# Altium project GN-1846-E-V2_HI3531A.PRJPCB (part 3 of 5)

## Sheet P06 Hi3531AV100(GND).SchDoc
size 420 x 297 mm
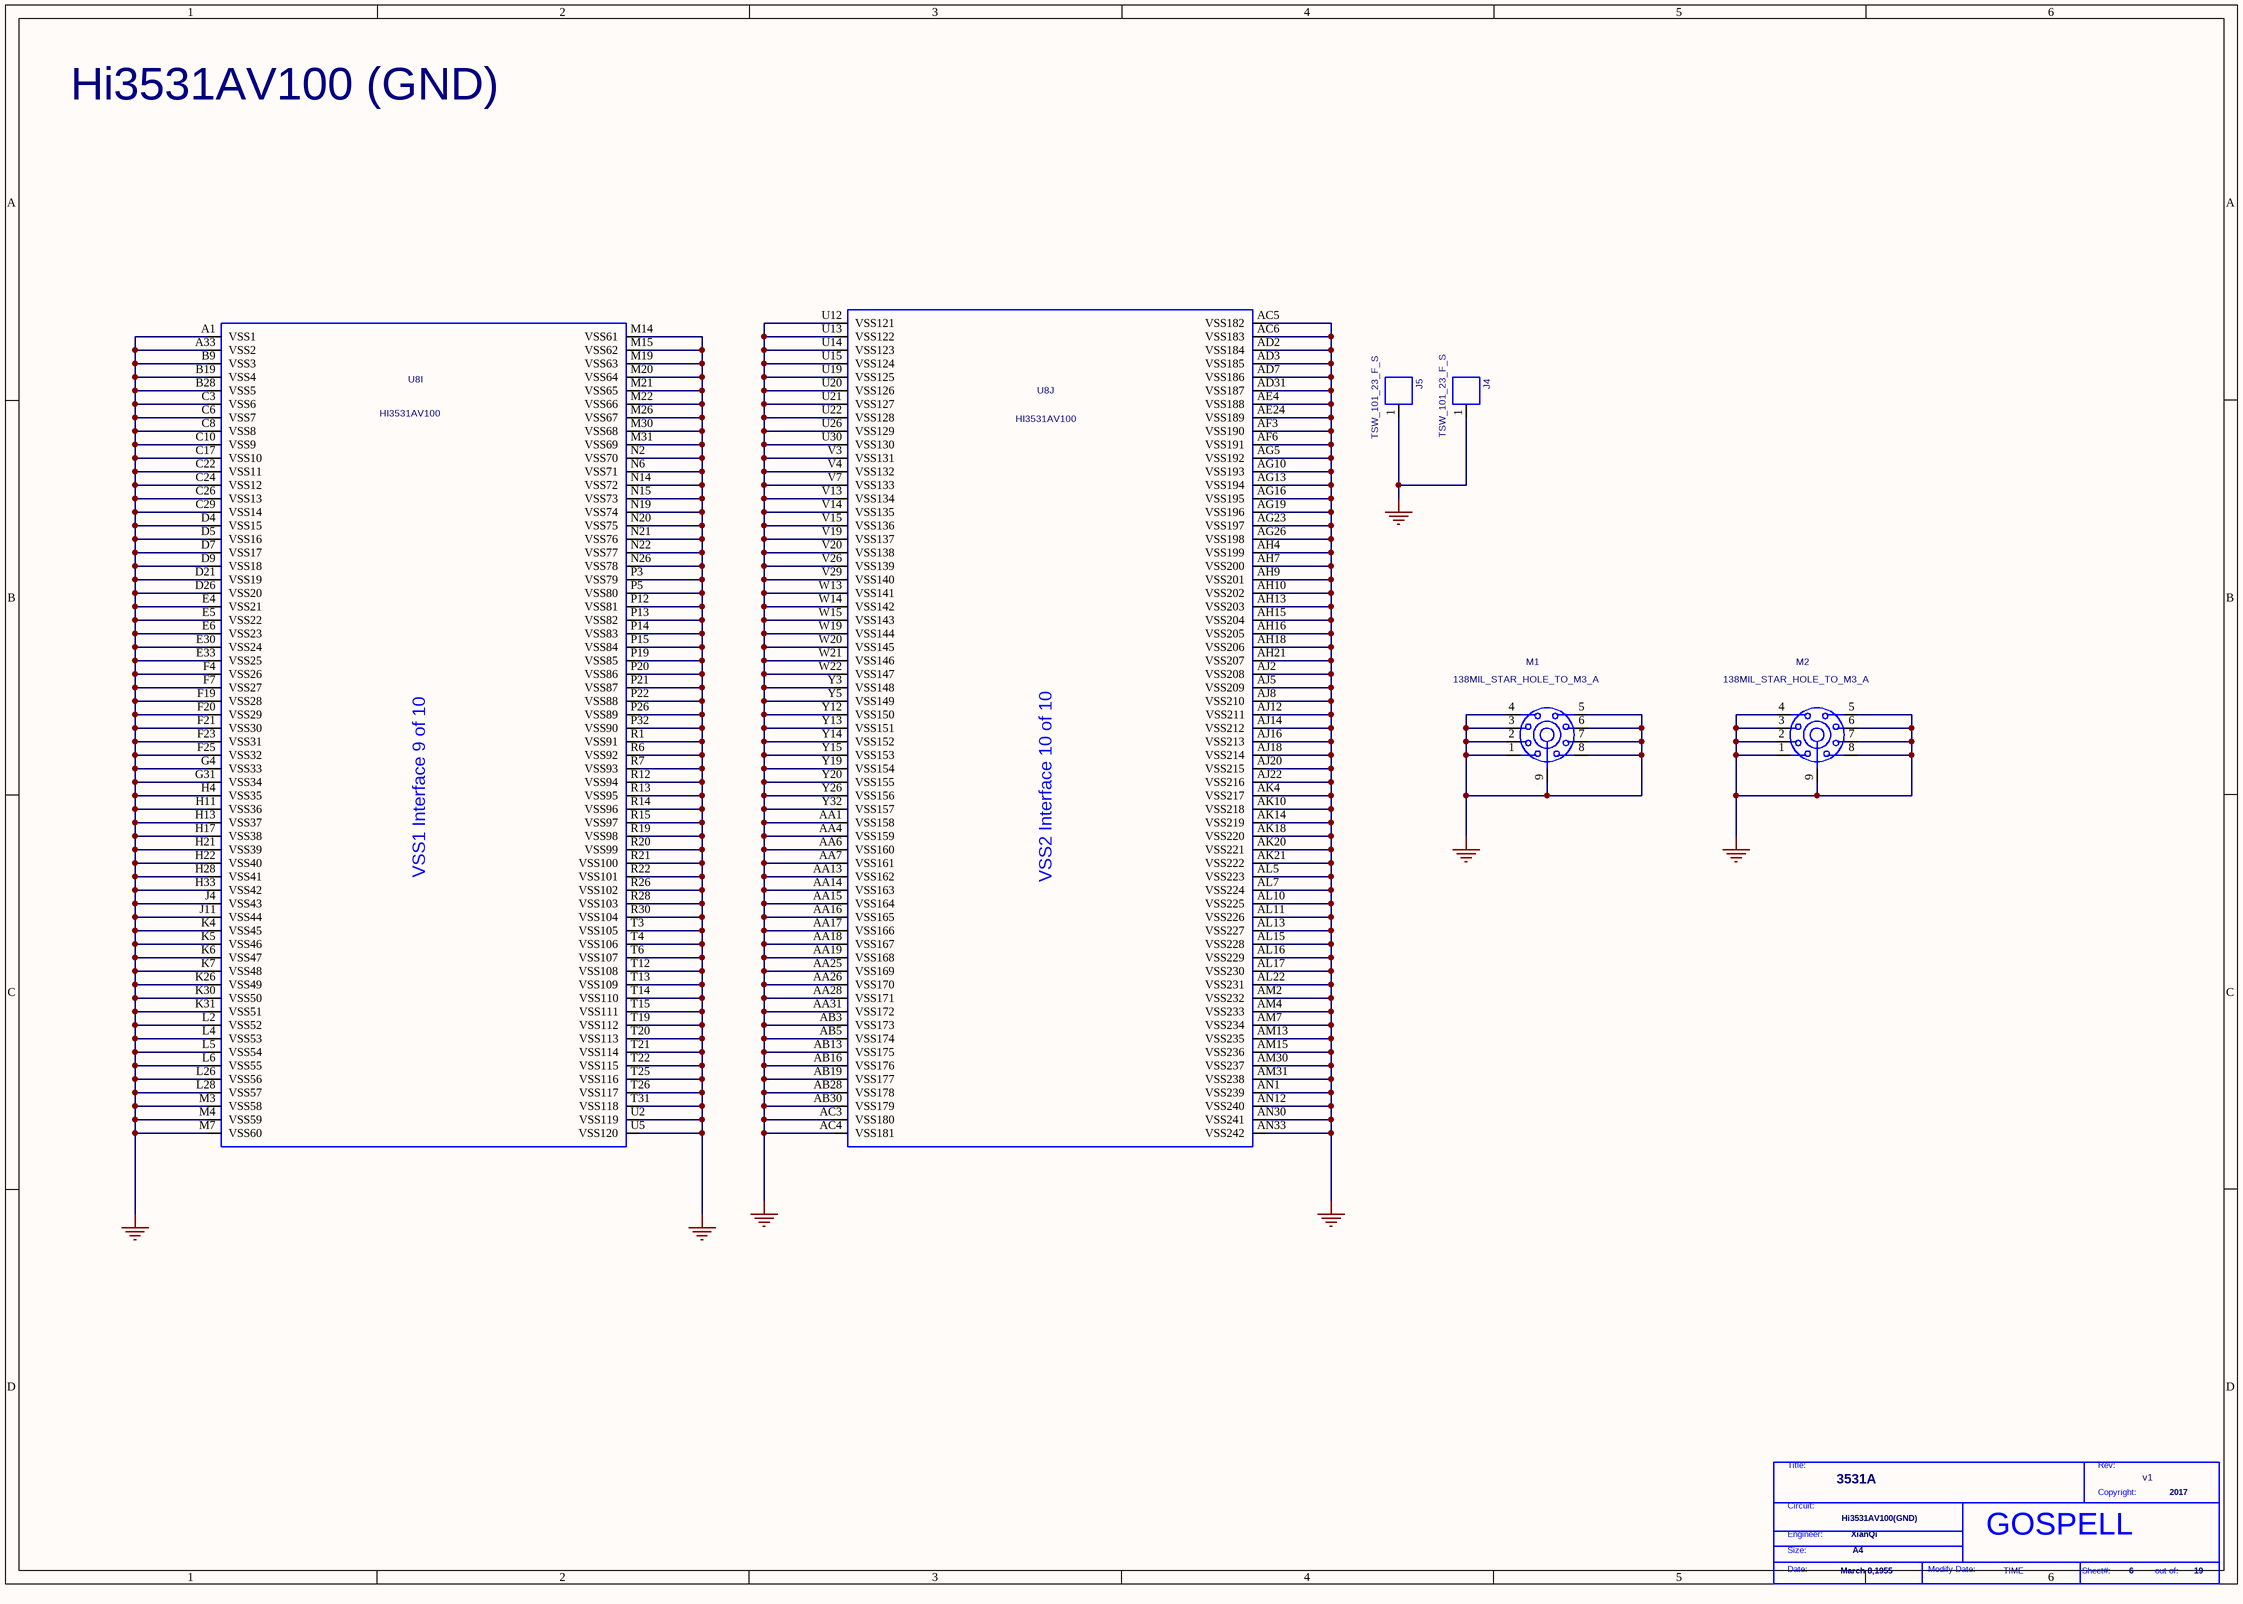
[diagram p12: P06 Hi3531AV100(GND).SchDoc]

### Parts
(Parts that share a designator on the sheet are numbered #1, #2 ... from top to bottom, then left to right.)
*#13  Page Modify Date: TIME  Engineer: XianQi  Copyright: 2017  Title: 3531A  RevCode: v1  Page Size: A4  Page Create Date: March 8,1955  Page Number: 6  Page Count: 19  Doc: Hi3531AV100(GND)  (hidden comment: GOSPELL)  (graphical)
J4  DEVICE: TSW_101_23_F_S  [SIP-1P]  (hidden comment: SIP-1P)
J5  DEVICE: TSW_101_23_F_S  [SIP-1P]  (hidden comment: SIP-1P)
M1  DEVICE: 138MIL_STAR_HOLE_TO_M3_A  [HOLE160-8STARAN]  (hidden comment: HOLE160-8STARAN)
M2  DEVICE: 138MIL_STAR_HOLE_TO_M3_A  [HOLE160-8STARAN]  (hidden comment: HOLE160-8STARAN)
U8  DEVICE: HI3531AV100  [BGA805-32-3333]  (hidden comment: BGA805-32-3333)  (parts I,J of 10)

### Nets
GND: J4.1 J5.1 M1.1(GND0) M1.2(GND1) M1.3(GND2) M1.4(GND3) M1.5(GND4) M1.6(GND5) M1.7(GND6) M1.8(GND7) M1.9(HOLE) M2.1(GND0) M2.2(GND1) M2.3(GND2) M2.4(GND3) M2.5(GND4) M2.6(GND5) M2.7(GND6) M2.8(GND7) M2.9(HOLE) U8.A1(VSS1) U8.A33(VSS2) U8.AA1(VSS158) U8.AA4(VSS159) U8.AA6(VSS160) U8.AA7(VSS161) U8.AA13(VSS162) U8.AA14(VSS163) U8.AA15(VSS164) U8.AA16(VSS165) U8.AA17(VSS166) U8.AA18(VSS167) U8.AA19(VSS168) U8.AA25(VSS169) U8.AA26(VSS170) U8.AA28(VSS171) U8.AA31(VSS172) U8.AB3(VSS173) U8.AB5(VSS174) U8.AB13(VSS175) U8.AB16(VSS176) U8.AB19(VSS177) U8.AB28(VSS178) U8.AB30(VSS179) U8.AC3(VSS180) U8.AC4(VSS181) U8.AC5(VSS182) U8.AC6(VSS183) U8.AD2(VSS184) U8.AD3(VSS185) U8.AD7(VSS186) U8.AD31(VSS187) U8.AE4(VSS188) U8.AE24(VSS189) U8.AF3(VSS190) U8.AF6(VSS191) U8.AG5(VSS192) U8.AG10(VSS193) U8.AG13(VSS194) U8.AG16(VSS195) U8.AG19(VSS196) U8.AG23(VSS197) U8.AG26(VSS198) U8.AH4(VSS199) U8.AH7(VSS200) U8.AH9(VSS201) U8.AH10(VSS202) U8.AH13(VSS203) U8.AH15(VSS204) U8.AH16(VSS205) U8.AH18(VSS206) U8.AH21(VSS207) U8.AJ2(VSS208) U8.AJ5(VSS209) U8.AJ8(VSS210) U8.AJ12(VSS211) U8.AJ14(VSS212) U8.AJ16(VSS213) U8.AJ18(VSS214) U8.AJ20(VSS215) U8.AJ22(VSS216) U8.AK4(VSS217) U8.AK10(VSS218) U8.AK14(VSS219) U8.AK18(VSS220) U8.AK20(VSS221) U8.AK21(VSS222) U8.AL5(VSS223) U8.AL7(VSS224) U8.AL10(VSS225) U8.AL11(VSS226) U8.AL13(VSS227) U8.AL15(VSS228) U8.AL16(VSS229) U8.AL17(VSS230) U8.AL22(VSS231) U8.AM2(VSS232) U8.AM4(VSS233) U8.AM7(VSS234) U8.AM13(VSS235) U8.AM15(VSS236) U8.AM30(VSS237) U8.AM31(VSS238) U8.AN1(VSS239) U8.AN12(VSS240) U8.AN30(VSS241) U8.AN33(VSS242) U8.B9(VSS3) U8.B19(VSS4) U8.B28(VSS5) U8.C3(VSS6) U8.C6(VSS7) U8.C8(VSS8) U8.C10(VSS9) U8.C17(VSS10) U8.C22(VSS11) U8.C24(VSS12) U8.C26(VSS13) U8.C29(VSS14) U8.D4(VSS15) U8.D5(VSS16) U8.D7(VSS17) U8.D9(VSS18) U8.D21(VSS19) U8.D26(VSS20) U8.E4(VSS21) U8.E5(VSS22) U8.E6(VSS23) U8.E30(VSS24) U8.E33(VSS25) U8.F4(VSS26) U8.F7(VSS27) U8.F19(VSS28) U8.F20(VSS29) U8.F21(VSS30) U8.F23(VSS31) U8.F25(VSS32) U8.G4(VSS33) U8.G31(VSS34) U8.H4(VSS35) U8.H11(VSS36) U8.H13(VSS37) U8.H17(VSS38) U8.H21(VSS39) U8.H22(VSS40) U8.H28(VSS41) U8.H33(VSS42) U8.J4(VSS43) U8.J11(VSS44) U8.K4(VSS45) U8.K5(VSS46) U8.K6(VSS47) U8.K7(VSS48) U8.K26(VSS49) U8.K30(VSS50) U8.K31(VSS51) U8.L2(VSS52) U8.L4(VSS53) U8.L5(VSS54) U8.L6(VSS55) U8.L26(VSS56) U8.L28(VSS57) U8.M3(VSS58) U8.M4(VSS59) U8.M7(VSS60) U8.M14(VSS61) U8.M15(VSS62) U8.M19(VSS63) U8.M20(VSS64) U8.M21(VSS65) U8.M22(VSS66) U8.M26(VSS67) U8.M30(VSS68) U8.M31(VSS69) U8.N2(VSS70) U8.N6(VSS71) U8.N14(VSS72) U8.N15(VSS73) U8.N19(VSS74) U8.N20(VSS75) U8.N21(VSS76) U8.N22(VSS77) U8.N26(VSS78) U8.P3(VSS79) U8.P5(VSS80) U8.P12(VSS81) U8.P13(VSS82) U8.P14(VSS83) U8.P15(VSS84) U8.P19(VSS85) U8.P20(VSS86) U8.P21(VSS87) U8.P22(VSS88) U8.P26(VSS89) U8.P32(VSS90) U8.R1(VSS91) U8.R6(VSS92) U8.R7(VSS93) U8.R12(VSS94) U8.R13(VSS95) U8.R14(VSS96) U8.R15(VSS97) U8.R19(VSS98) U8.R20(VSS99) U8.R21(VSS100) U8.R22(VSS101) U8.R26(VSS102) U8.R28(VSS103) U8.R30(VSS104) U8.T3(VSS105) U8.T4(VSS106) U8.T6(VSS107) U8.T12(VSS108) U8.T13(VSS109) U8.T14(VSS110) U8.T15(VSS111) U8.T19(VSS112) U8.T20(VSS113) U8.T21(VSS114) U8.T22(VSS115) U8.T25(VSS116) U8.T26(VSS117) U8.T31(VSS118) U8.U2(VSS119) U8.U5(VSS120) U8.U12(VSS121) U8.U13(VSS122) U8.U14(VSS123) U8.U15(VSS124) U8.U19(VSS125) U8.U20(VSS126) U8.U21(VSS127) U8.U22(VSS128) U8.U26(VSS129) U8.U30(VSS130) U8.V3(VSS131) U8.V4(VSS132) U8.V7(VSS133) U8.V13(VSS134) U8.V14(VSS135) U8.V15(VSS136) U8.V19(VSS137) U8.V20(VSS138) U8.V26(VSS139) U8.V29(VSS140) U8.W13(VSS141) U8.W14(VSS142) U8.W15(VSS143) U8.W19(VSS144) U8.W20(VSS145) U8.W21(VSS146) U8.W22(VSS147) U8.Y3(VSS148) U8.Y5(VSS149) U8.Y12(VSS150) U8.Y13(VSS151) U8.Y14(VSS152) U8.Y15(VSS153) U8.Y19(VSS154) U8.Y20(VSS155) U8.Y26(VSS156) U8.Y32(VSS157)

### Notes on the sheet
- Hi3531AV100 (GND)
- (in symbol GOSPELL) Title:; Rev:; Copyright:; Circuit:; Engineer:; Size:; Date:; Modify Date:; Sheet#:; out of:
- (in symbol HI3531AV100_M2_17, part I) VSS1 Interface 9 of 10
- (in symbol HI3531AV100_M2_17, part J) VSS2 Interface 10 of 10

### Library data of the parts
J4 = SIP1_0: PARTS: 1; LEVEL: STD; CODE: 14050101; OriginalSymbolOrigin: (10,30); %208%%161%%192%%224%%195%%251%%179%%198%: 插针; COMPONENT_HIGH_MAX: 8.6MM; %195%%232%%202%%246%: 插针-普通方脚插针-1PIN-单排-直式-5.84MM-2.92MM-2.54MM-THT; PKG_TYPE: SIP-1P
J5 = SIP1_0: PARTS: 1; LEVEL: STD; CODE: 14050101; OriginalSymbolOrigin: (10,30); %195%%232%%202%%246%: 插针-普通方脚插针-1PIN-单排-直式-5.84MM-2.92MM-2.54MM-THT; COMPONENT_HIGH_MAX: 8.6MM; %208%%161%%192%%224%%195%%251%%179%%198%: 插针; PKG_TYPE: SIP-1P
M1 M2 = HOLE-8STARS_0: PARTS: 1; LEVEL: STD; OriginalSymbolOrigin: (10,60); %195%%232%%202%%246%: M3螺钉(推荐使用)，对应138MIL星月孔，适用于过波峰焊设计。; PKG_TYPE: HOLE160-8STARAN
U8 = HI3531AV100_M2_17: FORWARD_PCB: 1; HETERO: (HI3531AV100_DDR1),(HI3531AV100_DDR2),(HI3531AV100_SYSTEM),(HI3531AV100_AD),(HI3531AV100_VO),(HI3531AV100_M1),(HI3531AV100_M2),(HI3531AV100_POWER),(HI3531AV100_VSS1),(HI3531AV100_VSS2); LEVEL: STD; OriginalSymbolOrigin: (30,630); CaptureCellPackProp: HI3531AV100_M2I; CODE: 35020607; PARTS: 1; PKG_TYPE: BGA805-32-3333